# Altium schematic sheet Sheet1.SchDoc
size A3; SheetNumber: 1; SheetTotal: 1; SPICEModelCacheCPTFZSDI: <root> / <DocumentId>CPTFZSDI</DocumentId> / <CacheFrame Number="0"> / <Model Name="umk316ab7475_l-t" Kind="CKT"> / <Text>* UMK316AB7475_L-T     SPICE MODEL  ( General Type ) / *-------------------------------------------------------------------------------------------------------- / * Model Generated by TAIYO YUDEN Corporation (http://www.ty-top.com) / * Version 1.0 / * TAIYO YUDEN Control No. 190215 / * Copyright(c) 2012 TAIYO YUDEN CO.,LTD. All Rights Reserved. / *-------------------------------------------------------------------------------------------------------- / * / * Products Name : Multilayer Ceramic Capacitors / * / * Characteristics : / *     Capacitance : 4.7 uF , Rated Voltage : 50V , TCC : X7R / *     Case Size : 3.2 x 1.6 / 0.126 x 0.063 [mm/inch] , Thickness : 1.6 / 0.063 [mm/inch] / *     (Conditions: Temperature = 25 degC , DC Bias Current/Voltage = 0A / 0V) / * / * Frequency Range : 40Hz - 3GHz / * / * External Node Assignments : / * / *  1  o---| |---o  2 / * / *-------------------------------------------------------------------------------------------------------- / .SubCkt UMK316AB7475_L-T 1 2 / **************************** / C0 1 110 4.2455u / Cm 1 101 0.21463u / C1 101 102 0.30648u / Rc1 101 102 787.3 / C2 102 103 0.28547u / Rc2 102 103 129.89 / C3 103 110 0.083106u / Rc3 103 110 14.697 / C2m 1 301 0.44425u / C21 301 302 1.0217u / Rc21 301 302 3.0262k / C22 302 303 1.2456u / Rc22 302 303 1.8046k / C23 303 304 1.3157u / Rc23 303 304 958.74 / C24 304 305 0.99675u / Rc24 304 305 371.33 / C25 305 306 0.57669u / Rc25 305 306 195.3 / C26 306 307 0.42291u / Rc26 306 307 92.453 / C27 307 308 0.20349u / Rc27 307 308 39.786 / C28 308 309 0.28312u / Rc28 308 309 18.832 / C29 309 110 0.04145u / Rc29 309 110 7.0132 / Rp0 1 110 21.277Meg / L0 110 120 0.27548n / Lm 120 130 0.32065n / L1 120 121 0.37269n / RL1 121 130 0.19231 / L2 120 122 0.48583n / RL2 122 130 0.24566 / L3 120 123 0.60575n / RL3 123 130 18.468 / CR 120 124 0.65041u / LR 124 125 0.59689n / RR 125 130 39.133m / CL 130 140 5.5671p / LL 130 140 0.30868n / RL 130 140 7.7166 / Rs 140 2 3.8119m / **************************** / .ends UMK316AB7475_L-T</Text> / </Model> / <Model Name="umk105b7682_v-f" Kind="CKT"> / <Text>* UMK105B7682_V-F     SPICE MODEL  ( General Type ) / *-------------------------------------------------------------------------------------------------------- / * Model Generated by TAIYO YUDEN Corporation (http://www.ty-top.com) / * Version 1.0 / * TAIYO YUDEN Control No. 170508_080613 / * Copyright(c) 2012 TAIYO YUDEN CO.,LTD. All Rights Reserved. / *-------------------------------------------------------------------------------------------------------- / * / * Products Name : Multilayer Ceramic Capacitors / * / * Characteristics : / *     Capacitance : 6800 pF , Rated Voltage : 50V , TCC : X7R / *     Case Size : 1.0 x 0.5 / 0.039 x 0.02 [mm/inch] , Thickness : 0.5 / 0.02 [mm/inch] / *     (Conditions: Temperature = 25 degC , DC Bias Current/Voltage = 0A / 0V) / * / * Frequency Range : 40Hz - 3GHz / * / * External Node Assignments : / * / *  1  o---| |---o  2 / * / *-------------------------------------------------------------------------------------------------------- / .SubCkt UMK105B7682_V-F 1 2 / **************************** / C0 1 110 5825.1p / Cm 1 101 474.96p / C1 101 102 1651.5p / Rc1 101 102 235.8k / C2 102 103 802.21p / Rc2 102 103 9.8793k / C3 103 110 129.55p / Rc3 103 110 329.06 / C2m 1 301 581.21p / C21 301 302 4468.7p / Rc21 301 302 1.1158G / C22 302 303 5994.1p / Rc22 302 303 757.43k / C23 303 304 4569.8p / Rc23 303 304 462.62k / C24 304 305 3426.1p / Rc24 304 305 19.595k / C25 305 306 2043.2p / Rc25 305 306 31.838k / C26 306 307 3752.9p / Rc26 306 307 660.98 / C27 307 308 1017.9p / Rc27 307 308 421.87 / C28 308 309 320.03p / Rc28 308 309 1.2971k / C29 309 110 5.5474p / Rc29 309 110 160.37 / Rp0 1 110 10G / L0 110 120 0.25038n / Lm 120 130 0.068156n / L1 120 121 4.4767p / RL1 121 130 0.67168 / L2 120 122 0.013458n / RL2 122 130 2.3566 / L3 120 123 0.02002n / RL3 123 130 4.3213 / CR 120 124 1397.3p / LR 124 125 0.079981n / RR 125 130 0.45026 / CL 130 140 1.4554p / LL 130 140 0.22551n / RL 130 140 75.413 / Rs 140 2 73.494m / **************************** / .ends UMK105B7682_V-F</Text> / </Model> / </CacheFrame> / </root>
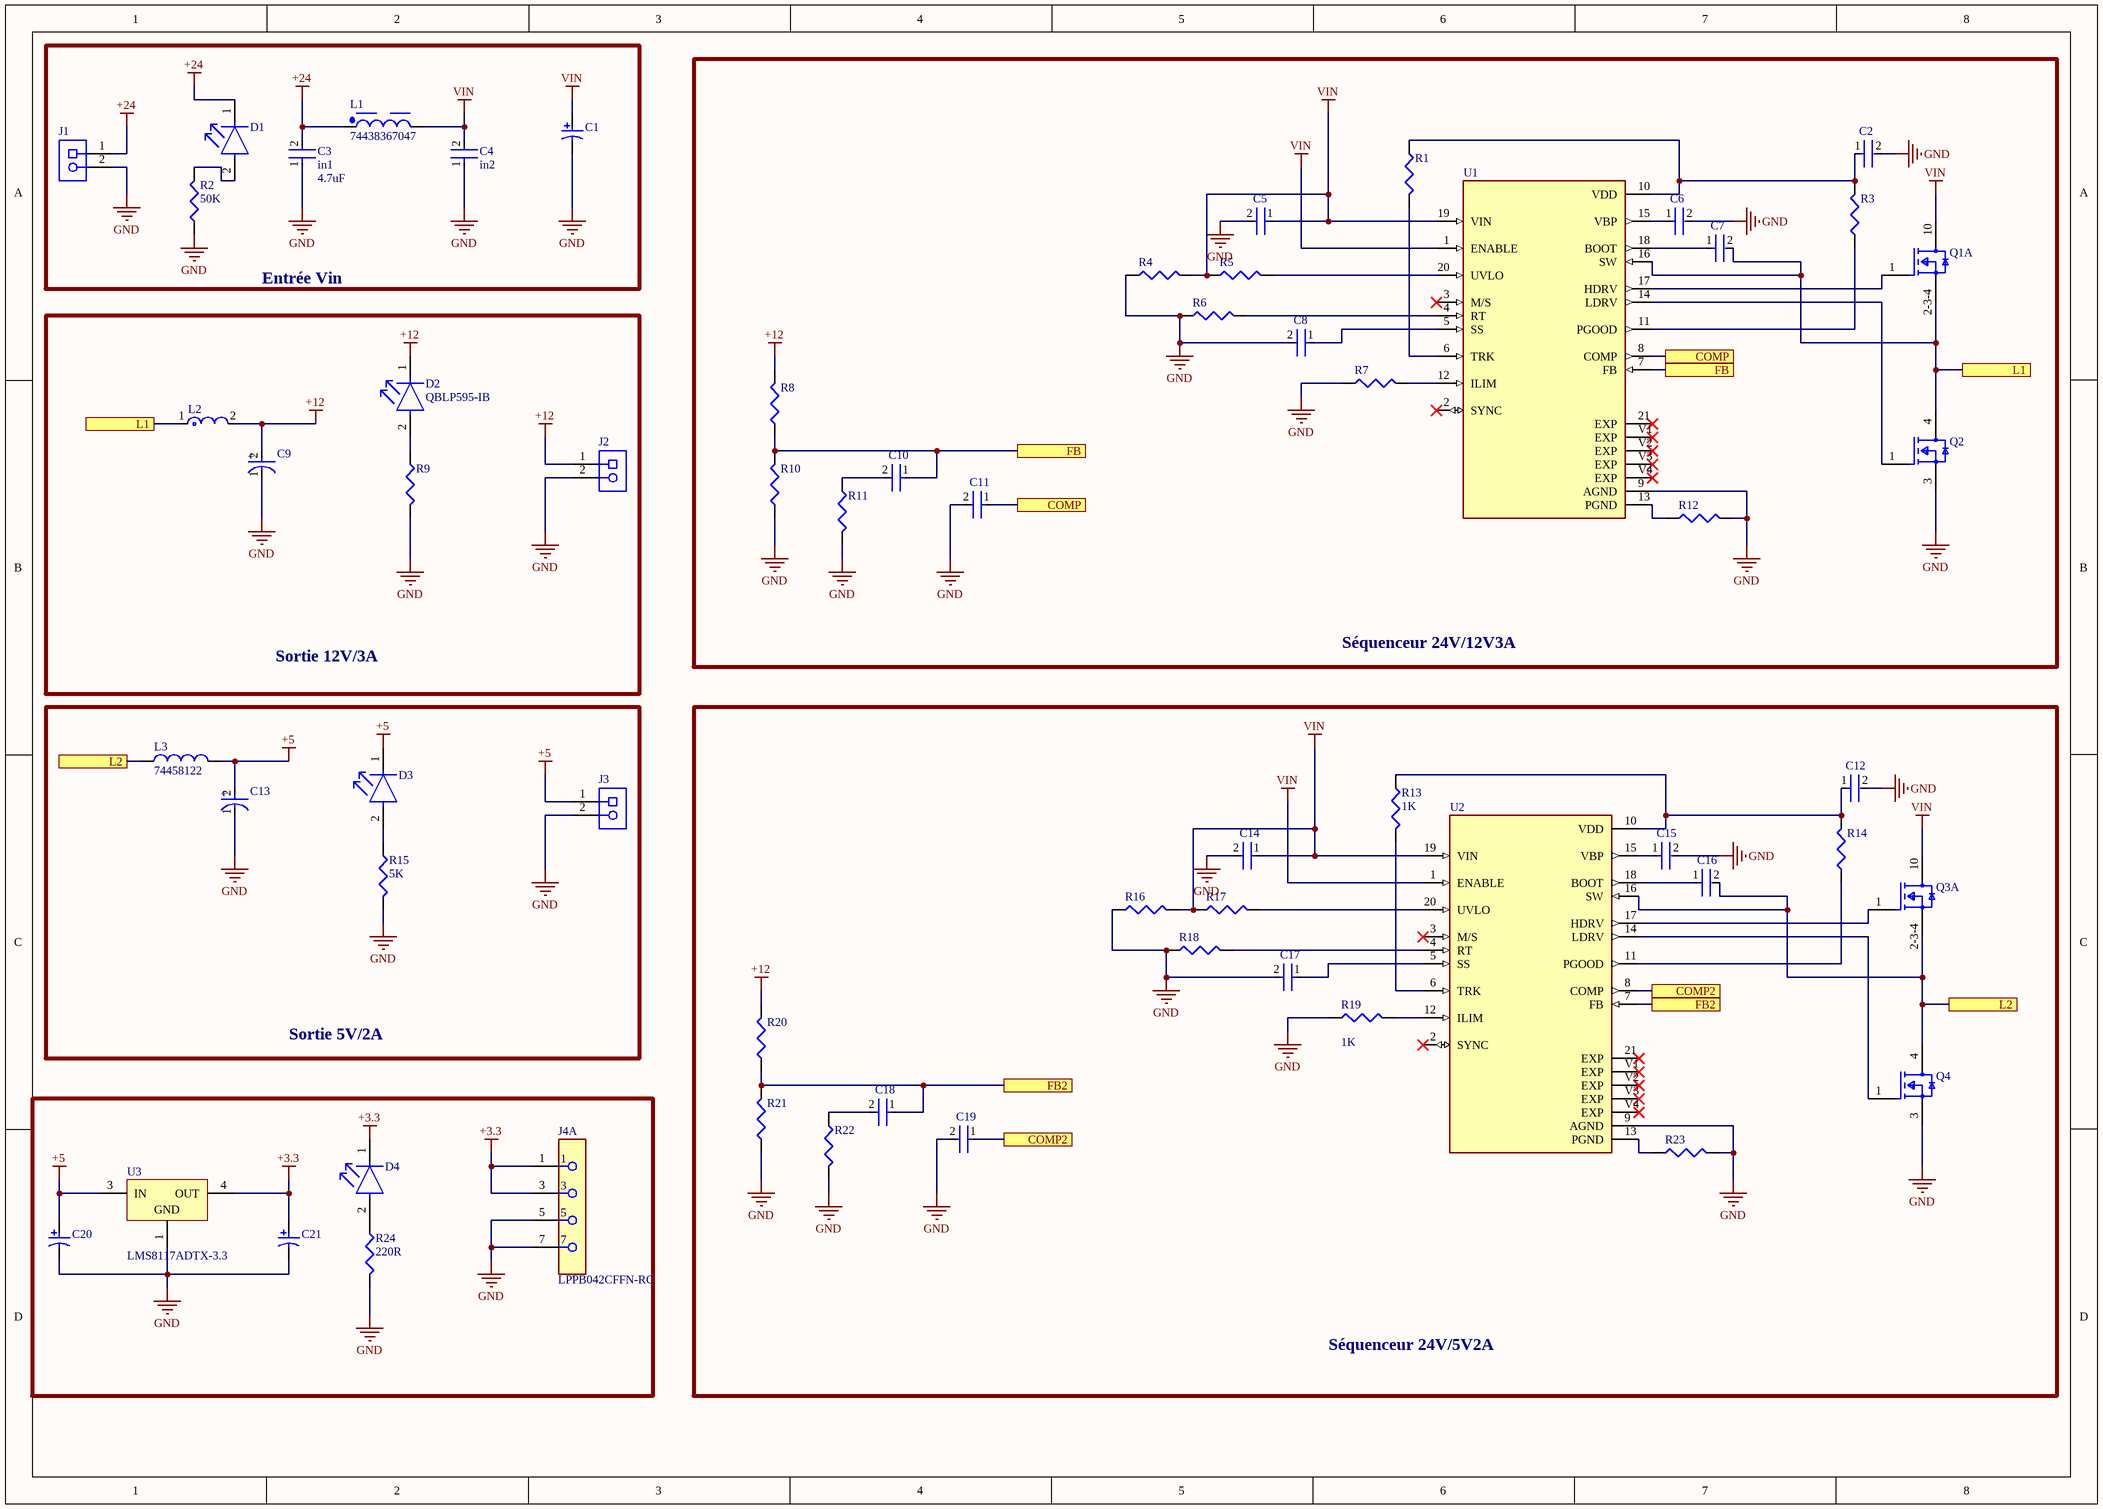
[diagram p0: Sheet1.SchDoc]

## Parts
C1  UUD1H100MCL1GS  [NIC-CAPA2-6.3X5.8_V]  (value not drawn)
C2  (no value)  [FP-0402-L_1_0_0_05-W_0_5-IPC_C]
C3  in1  Capacitance: 4.7uF  [FP-1206-L_3_2_0_2-W_1_6_0-IPC_B]
C4  in2  [FP-0402-L_1_0_0_05-W_0_5-IPC_C]
C5  (no value)  [FP-0402-L_1_0_0_05-W_0_5-IPC_C]
C6  (no value)  [FP-0402-L_1_0_0_05-W_0_5-IPC_C]
C7  (no value)  [FP-0402-L_1_0_0_05-W_0_5-IPC_C]
C8  (no value)  [FP-0402-L_1_0_0_05-W_0_5-IPC_C]
C9  HHXC500ARA101MJA0G  [FP-HXC-ALA0-MFG]  (value not drawn)
C10  (no value)  [FP-0402-L_1_0_0_05-W_0_5-IPC_C]
C11  (no value)  [FP-0402-L_1_0_0_05-W_0_5-IPC_C]
C12  (no value)  [FP-0402-L_1_0_0_05-W_0_5-IPC_C]
C13  HHXC500ARA101MJA0G  [FP-HXC-ALA0-MFG]  (value not drawn)
C14  (no value)  [FP-0402-L_1_0_0_05-W_0_5-IPC_C]
C15  (no value)  [FP-0402-L_1_0_0_05-W_0_5-IPC_C]
C16  (no value)  [FP-0402-L_1_0_0_05-W_0_5-IPC_C]
C17  (no value)  [FP-0402-L_1_0_0_05-W_0_5-IPC_C]
C18  (no value)  [FP-0402-L_1_0_0_05-W_0_5-IPC_C]
C19  (no value)  [FP-0402-L_1_0_0_05-W_0_5-IPC_C]
C20  UUD1H100MCL1GS  [NIC-CAPA2-6.3X5.8_V]  (value not drawn)
C21  UUD1H100MCL1GS  [NIC-CAPA2-6.3X5.8_V]  (value not drawn)
D1  APT1608LZGCK  [FP-APT1608LZGCK-MFG]  (value not drawn)
D2  QBLP595-IB  [FP-QBLP595-IB-MFG]
D3  SML-P11VTT86R  [FP-SML-P1-MFG]  (value not drawn)
D4  APTD1608SYC/J3  [FP-APTD1608SYC-J3-MFG]  (value not drawn)
J1  1729128  [PHOE-1729128-2_V]  (value not drawn)
J2  12V  [PHOE-1729128-2_V]  (value not drawn)
J3  12V  [PHOE-1729128-2_V]  (value not drawn)
J4  LPPB042CFFN-RC  [FP-LPPB042CFFN-RC-MFG]  (part A of 2)
L1  74438367047  [WE-MAPI_5030]
L2  XAL5050-223MEC  [FP-XAL5050-223MEC-MFG]  (value not drawn)
L3  74458122  [WE-PD4_Type X]
Q1  HS1  [FP-511DG-MFG]  (value not drawn)  (part A of 2)
Q2  LS1  [FP-369AS-MFG]  (value not drawn)
Q3  HS1  [FP-511DG-MFG]  (value not drawn)  (part A of 2)
Q4  LS1  [FP-369AS-MFG]  (value not drawn)
R1  Res3  [J1-0603]  (value not drawn)
R2  value 50K  [J1-0603]  (hidden comment: Res3)
R3  Res3  [J1-0603]  (value not drawn)
R4  Res3  [J1-0603]  (value not drawn)
R5  Res3  [J1-0603]  (value not drawn)
R6  Res3  [J1-0603]  (value not drawn)
R7  Res3  [J1-0603]  (value not drawn)
R8  Res3  [J1-0603]  (value not drawn)
R9  Res3  [J1-0603]  (value not drawn)
R10  Res3  [J1-0603]  (value not drawn)
R11  Res3  [J1-0603]  (value not drawn)
R12  Res3  [J1-0603]  (value not drawn)
R13  value 1K  [J1-0603]  (hidden comment: Res3)
R14  Res3  [J1-0603]  (value not drawn)
R15  value 5K  [J1-0603]  (hidden comment: Res3)
R16  Res3  [J1-0603]  (value not drawn)
R17  Res3  [J1-0603]  (value not drawn)
R18  Res3  [J1-0603]  (value not drawn)
R19  value 1K  [J1-0603]  (hidden comment: Res3)
R20  Res3  [J1-0603]  (value not drawn)
R21  Res3  [J1-0603]  (value not drawn)
R22  Res3  [J1-0603]  (value not drawn)
R23  Res3  [J1-0603]  (value not drawn)
R24  value 220R  [J1-0603]  (hidden comment: Res3)
U1  TPS40170RGYT  [QFN50P350X450X100-21N]  (value not drawn)
U2  TPS40170RGYT  [QFN50P350X450X100-21N]  (value not drawn)
U3  LMS8117ADTX-3.3  [TD03B_M]

## Blocks framed on the sheet
Entrée Vin: C1 C3 C4 D1 J1 L1 R2
Séquenceur 24V/12V3A: C2 C5-C8 C10 C11 Q1 Q2 R1 R3-R8 R10-R12 U1
Sortie 12V/3A: C9 D2 J2 L2 R9
Sortie 5V/2A: C13 D3 J3 L3 R15
Séquenceur 24V/5V2A: C12 C14-C19 Q3 Q4 R13 R14 R16-R23 U2

## Ports
COMP2 (see Sheet1[4D]), COMP2 (see Sheet1[7C]), COMP (see Sheet1[4B]), COMP (see Sheet1[7A]), FB2 (see Sheet1[4C]), FB2 (see Sheet1[7C]), FB (see Sheet1[4B]), FB (see Sheet1[7A]), L1 (see Sheet1[1B]), L1 (see Sheet1[8A]), L2 (see Sheet1[1C]), L2 (see Sheet1[8C])

## Nets
+3.3: C21.1 D4.1(C) J4.1 J4.3 U3.4(OUT)
+5: C13.2(A) C20.1 D3.1(C) J3.1 L3.2 U3.3(IN)
+12: C9.2(A) D2.1(C) J2.1 L2.2 R8.2 R20.2
+24: C3.2 D1.1(C) J1.1 L1.1
GND: C1.2 C2.2 C3.1 C4.1 C5.2 C6.2 C8.2 C9.1(C) C11.2 C12.2 C13.1(C) C14.2 C15.2 C17.2 C19.2 C20.2 C21.2 J1.2 J2.2 J3.2 J4.5 J4.7 Q2.3(S) Q4.3(S) R2.1 R4.1 R6.1 R7.1 R9.2 R10.1 R11.2 R12.2 R15.2 R16.1 R18.1 R19.1 R21.1 R22.2 R23.2 R24.2 U1.9(AGND) U2.9(AGND) U3.1(GND)
VIN: C1.1 C4.2 C5.1 C14.1 L1.2 Q1.10(D1) Q3.10(D1) R4.2 R5.1 R16.2 R17.1 U1.1(ENABLE) U1.19(VIN) U2.1(ENABLE) U2.19(VIN)
COMP: C11.1 U1.8(COMP) ; port COMP
COMP2: C19.1 U2.8(COMP) ; port COMP2
FB: C10.1 R8.1 R10.2 U1.7(FB) ; port FB
FB2: C18.1 R20.1 R21.2 U2.7(FB) ; port FB2
L1: C7.2 L2.1 Q1.2-3-4(S1) Q2.4(D) U1.16(SW) ; port L1
L2: C16.2 L3.1 Q3.2-3-4(S1) Q4.4(D) U2.16(SW) ; port L2
NetC2_1: C2.1 R1.1 R3.2 U1.10(VDD)
NetC6_1: C6.1 U1.15(VBP)
NetC7_1: C7.1 U1.18(BOOT)
NetC8_1: C8.1 U1.5(SS)
NetC10_2: C10.2 R11.1
NetC12_1: C12.1 R13.1 R14.2 U2.10(VDD)
NetC15_1: C15.1 U2.15(VBP)
NetC16_1: C16.1 U2.18(BOOT)
NetC17_1: C17.1 U2.5(SS)
NetC18_2: C18.2 R22.1
NetD1_2: D1.2(A) R2.2
NetD2_2: D2.2(A) R9.1
NetD3_2: D3.2(A) R15.1
NetD4_2: D4.2(A) R24.1
NetQ1_1: Q1.1(G1) U1.17(HDRV)
NetQ2_1: Q2.1(G) U1.14(LDRV)
NetQ3_1: Q3.1(G1) U2.17(HDRV)
NetQ4_1: Q4.1(G) U2.14(LDRV)
NetR1_2: R1.2 U1.6(TRK)
NetR3_1: R3.1 U1.11(PGOOD)
NetR5_2: R5.2 U1.20(UVLO)
NetR6_2: R6.2 U1.4(RT)
NetR7_2: R7.2 U1.12(ILIM)
NetR12_1: R12.1 U1.13(PGND)
NetR13_2: R13.2 U2.6(TRK)
NetR14_1: R14.1 U2.11(PGOOD)
NetR17_2: R17.2 U2.20(UVLO)
NetR18_2: R18.2 U2.4(RT)
NetR19_2: R19.2 U2.12(ILIM)
NetR23_1: R23.1 U2.13(PGND)

Not connected (* = marked no-connect by the designer): U1 2(SYNC)* 3(M/S)* 21(EXP)* V1(EXP)* V2(EXP)* V3(EXP)* V4(EXP)*; U2 2(SYNC)* 3(M/S)* 21(EXP)* V1(EXP)* V2(EXP)* V3(EXP)* V4(EXP)*

## Notes on the sheet
- (in symbol CMP-33769-000007-1) +

## Library data of the parts
C1 = CMP-0687-00043-1: Aluminum Electrolytic Capacitor, UD Series, Low Impedance, 10 uF, 50 V, + / - 20%, -55 to 105 degC, Chip Type, 6.3 x 5.8 mm D x L, Pb-Free, Reel; Manufacturer: Nichicon; Impedance: 0.88 Ohm; Rated Voltage: 50 V; Endurance Time: 2000 h; Rated Ripple Current (at 100kHz): 165 mA; Packing: Dia382mm Reel; Rated Capacitance: 10 uF; Tolerance Rated Capacitance: -20 to 20%; ComponentLink2Description: Datasheet; Length: 5.8 mm; ComponentLink2URL: http://products.nichicon.co.jp/en/pdf/XJA043/e-ud.pdf; RoHS: TRUE; DatasheetVersion: 08/2012; ComponentLink3URL: http://products.nichicon.co.jp/en/pdf/XJA043/e-ud.pdf; ComponentLink3Description: Package Specification; ComponentLink1Description: Manufacturer URL; Mounting Technology: Surface Mount; PartNumber: UUD1H100MCL1GS; ComponentLink1URL: http://www.nichicon.co.jp/; PackageDescription: 2-Pin Surface Mount Device, Diameter 6.3 mm, Height 5.8 mm, Pitch 5.4 mm; PackageReference: CAPAE-D6.3H5.8; Diameter: 6.3 mm
C2 C5 C7 C8 C10-C12 C14 C16-C19 = CMP-14477-001974-2: None; Voltage Rating: 50V; Dielectric: X7R; Tolerance: 10%; Capacitance: 0.1uF; Series: M; Termination: SMD/SMT; Halogen Free: Halogen Free; Radiation Hardening: No; Package Quantity: 10000; Thickness: 0.022inch; Case/Package: 0402; Case Code (Metric): 1005; Max Operating Temperature: 125°C; Depth: 0.5mm; Case Code (Imperial): 0402; Construction: Flat; Length: 1mm; Lead Free: Lead Free; Voltage Rating (DC): 50V; RoHS Compliant: Yes; Mount: Surface Mount; Width: 0.02inch; Height: 0.5mm; Voltage: 50V; Packaging: Tape and Reel; Min Operating Temperature: -55°C
C3 = CMP-2000-07358-3: None; Dielectric: X7R; Tolerance: 10%; Voltage Rating (DC): 50V; Radiation Hardening: No; Case Code (Metric): 3216; Thickness: 0.071inch; Series: M; Number of Pins: 2; Depth: 1.6mm; Mount: Surface Mount; Case/Package: 1206; Min Operating Temperature: -55°C; Width: 1.6mm; RoHS Compliant: Yes; Voltage Rating: 50V; Package Quantity: 2000; Length: 3.2mm; Packaging: Tape and Reel; Height: 1.6mm; Termination: SMD/SMT; Construction: Flat; Max Operating Temperature: 125°C; Case Code (Imperial): 1206
C4 = CMP-14477-001974-2: None; Voltage Rating: 50V; Dielectric: X7R; Tolerance: 10%; Capacitance: 6.8nF; Series: M; Termination: SMD/SMT; Halogen Free: Halogen Free; Radiation Hardening: No; Package Quantity: 10000; Thickness: 0.022inch; Case/Package: 0402; Case Code (Metric): 1005; Max Operating Temperature: 125°C; Depth: 0.5mm; Case Code (Imperial): 0402; Construction: Flat; Length: 1mm; Lead Free: Lead Free; Voltage Rating (DC): 50V; RoHS Compliant: Yes; Mount: Surface Mount; Width: 0.02inch; Height: 0.5mm; Voltage: 50V; Packaging: Tape and Reel; Min Operating Temperature: -55°C
C6 C15 = CMP-14477-001974-2: None; Voltage Rating: 50V; Dielectric: X7R; Tolerance: 10%; Capacitance: 4.7uF; Series: M; Termination: SMD/SMT; Halogen Free: Halogen Free; Radiation Hardening: No; Package Quantity: 10000; Thickness: 0.022inch; Case/Package: 0402; Case Code (Metric): 1005; Max Operating Temperature: 125°C; Depth: 0.5mm; Case Code (Imperial): 0402; Construction: Flat; Length: 1mm; Lead Free: Lead Free; Voltage Rating (DC): 50V; RoHS Compliant: Yes; Mount: Surface Mount; Width: 0.02inch; Height: 0.5mm; Voltage: 50V; Packaging: Tape and Reel; Min Operating Temperature: -55°C
C9 C13 = CMP-33769-000007-1: CAP ALUM POLY 100UF 20% 50V SMD; Life (Hours): 4000Hour; ESR (Equivalent Series Resistance): 25mR; Packaging: Cut Tape; Case/Package: Radial; Capacitance: 100uF; Resistor Type: Hybrid; Max Operating Temperature: 125°C; Voltage Rating: 50V; Min Operating Temperature: -55°C; RoHS Compliant: Yes; Tolerance: 20%; Ratings: AEC-Q200; Mount: Surface Mount
C20 = CMP-0687-00043-1: Aluminum Electrolytic Capacitor, UD Series, Low Impedance, 10 uF, 50 V, + / - 20%, -55 to 105 degC, Chip Type, 6.3 x 5.8 mm D x L, Pb-Free, Reel; Manufacturer: Nichicon; Impedance: 0.88 Ohm; Rated Voltage: 50 V; Endurance Time: 2000 h; Rated Ripple Current (at 100kHz): 165 mA; Packing: Dia382mm Reel; Rated Capacitance: 0.47 uF; Tolerance Rated Capacitance: -20 to 20%; ComponentLink2Description: Datasheet; Length: 5.8 mm; ComponentLink2URL: http://products.nichicon.co.jp/en/pdf/XJA043/e-ud.pdf; RoHS: TRUE; DatasheetVersion: 08/2012; ComponentLink3URL: http://products.nichicon.co.jp/en/pdf/XJA043/e-ud.pdf; ComponentLink3Description: Package Specification; ComponentLink1Description: Manufacturer URL; Mounting Technology: Surface Mount; PartNumber: UUD1H100MCL1GS; ComponentLink1URL: http://www.nichicon.co.jp/; PackageDescription: 2-Pin Surface Mount Device, Diameter 6.3 mm, Height 5.8 mm, Pitch 5.4 mm; PackageReference: CAPAE-D6.3H5.8; Diameter: 6.3 mm
C21 = CMP-0687-00043-1: Aluminum Electrolytic Capacitor, UD Series, Low Impedance, 10 uF, 50 V, + / - 20%, -55 to 105 degC, Chip Type, 6.3 x 5.8 mm D x L, Pb-Free, Reel; Manufacturer: Nichicon; Impedance: 0.88 Ohm; Rated Voltage: 50 V; Endurance Time: 2000 h; Rated Ripple Current (at 100kHz): 165 mA; Packing: Dia382mm Reel; Rated Capacitance: 33 uF; Tolerance Rated Capacitance: -20 to 20%; ComponentLink2Description: Datasheet; Length: 5.8 mm; ComponentLink2URL: http://products.nichicon.co.jp/en/pdf/XJA043/e-ud.pdf; RoHS: TRUE; DatasheetVersion: 08/2012; ComponentLink3URL: http://products.nichicon.co.jp/en/pdf/XJA043/e-ud.pdf; ComponentLink3Description: Package Specification; ComponentLink1Description: Manufacturer URL; Mounting Technology: Surface Mount; PartNumber: UUD1H100MCL1GS; ComponentLink1URL: http://www.nichicon.co.jp/; PackageDescription: 2-Pin Surface Mount Device, Diameter 6.3 mm, Height 5.8 mm, Pitch 5.4 mm; PackageReference: CAPAE-D6.3H5.8; Diameter: 6.3 mm
D1 = CMP-44529-000040-1: LED GREEN CLEAR 2SMD; Dominant Wavelength: 525nm; Forward Voltage: 2.65V; Luminous Intensity: 50mcd; Test Current: 2mA; Viewing Angle: 120°; Lens Color: Colorless; Width: 0.8mm; Mount: Surface Mount; Lens Transparency: Clear; Length: 1.6mm; Packaging: Cut Tape; Case Code (Metric): 1608; Height: 0.75mm; Case/Package: 0603; Case Code (Imperial): 0603; Color: Green
D2 = CMP-113271-000002-1: LED BLUE CLEAR 0402 SMD; Lens Size: 0.5mm; Dominant Wavelength: 465nm; Forward Voltage: 3.1V; Lens Color: Colorless; Luminous Intensity: 85mcd; Test Current: 20mA; Viewing Angle: 140°; Lens Style: Flat; Width: 0.5mm; Case Code (Metric): 1005; Lens Transparency: Clear; Color: Blue; Packaging: Tape and Reel; Case Code (Imperial): 0402; Mount: Surface Mount; Length: 1mm; Case/Package: 0402; Height: 0.6mm
D3 = CMP-08952-000003-1: LED RED CLEAR 1006 SMD; Manufacturer: Rohm; Led Orientation: Top View; Power Dissipation: 50mW; Wavelength: 626nm; Forward Voltage: 1.8V; Forward Current: 1mA; Luminous Intensity: 4mcd; Reverse Voltage: 5V; ComponentLink2URL: https://www.rohm.com/datasheet/SML-P11VT(R)/sml-p11-e; Temperature: -40°C to +85°C; Device Class L2: LEDs; Package: SML-P1; Category: Diode; Automotive: No; RoHS: TRUE; Lead Free: Yes; Digikey Description: LED RED CLEAR 1006 SMD; Manufacturer Part Number: SML-P11VTT86R; Device Class L3: unset; ComponentLink2Description: Datasheet; Octopart: https://octopart.com/sml-p11vtt86r-rohm-34112314; Device Class L1: Optoelectronics; Temperature Range High: +85°C; Temperature Range Low: -40°C; Mouser Description: SML-P11 Series Red 0402 Clear 4 mcd 1.8 V Surface Mount PICOLED? LED; Height: 0.25mm; Colour: Red
D4 = CMP-44529-000016-1: LED YELLOW CLEAR CHIP SMD; Forward Current: 20mA; Luminous Intensity: 900mcd; Dominant Wavelength: 590nm; Viewing Angle: 60°; Lens Color: Colorless; Forward Voltage: 2V; Case Code (Imperial): 0603; Lens Transparency: Clear; Height: 0.95mm; Case Code (Metric): 1608; Package Quantity: 2000; Mount: Surface Mount; Test Current: 20mA; Max Operating Temperature: 85°C; Length: 1.6mm; Lens Style: Clear; Illumination Color: Yellow; Packaging: Tape and Reel; Case/Package: 0603; Color: Yellow; Width: 0.8mm; Lead Free: Lead Free; Min Operating Temperature: -40°C
J1 = CMP-2000-05815-1: PCB Terminal Block, 13.5 A, 400 V, 2-Pin THD, RoHS, Bulk; Manufacturer: Phoenix Contact; Package Version: 03/2015; No. of Rows: 1; Pitch: 5.08mm; No. of Positions: 2; Voltage Rating: 400V; Current Rating: 13500mA; Manufacturer URL: http://www.phoenixcontact.com/; Datasheet URL: https://datasheet.ciiva.com/16046/1729128-16046181.pdf; RoHS: TRUE; Package URL: https://www.phoenixcontact.com/online/portal/pi/pxc/product_detail_page/!ut/p/b1/3VdJjqNKFDxLH8AFycySyWY2ozFsEPOMMQaDOX1XedGL_1Vdm5YXJleknhSKeBkvI6EA8ncAo3AYoDhBQGco6KN7VURTdemj9us_IEKEZo_YHiPAEWEFmDGOHMORkqKYCORBZxgL7ZoaZYcbFFUZ3fqxSY6GOuxydWUuHqz1ynmMFygu583Bob0Ewr6Sd_l-5m-kAueHiB0jpRwZwe58wwtkpxtMYd_LmGcDRU02dRNEyWt6Y2ti5pSyJ_reIkzIulrqApdnbT11V5jnCKbYNCvhEM1MCpPByat_X379-iThf08CI5GfOPqfBeS3BRoBOdD55AKVv0iLwCMq-2BrzXWSGRH7pUGD9uwXQjiph3xL0DKQwdGa0JImiIOmBNOestqgwTHSSs2oOep-78apyXQBvNi8ZLaFjvjWvcaUEBu0MC6Wbe-d6mB0FAebo2lUWinqYaZs5DAYzV0RP9yitUjnGJ0iI9xhZkT42OCQNUJJhkgWINNQLP2JFP6OpMg3JCVg70jqHT0lvKOnhHf0lPuOnnLf0VPuWx6_dxwUIvwk5WMkT0kLL1mh61l2yZVSzG3pYV_bqo-mj6uMKwKwdnnW8Jh5RTOJzMOA5c-eJDaZQw4mTMPH02PvS_ZAqNVjVTo2WyYLkwH_KU1mmmG5kjRhDqPXLwwVHvVOjCM60-fpXvTDfMGW1PVFVS1r4e4yVDk4ZdNbkUHvqPqQSeian4UD39fNKmachqdJ1NJbyk8rXT9mXTvPk3oE5meulKGgiruPJek-4I9hTT6G8ZLOyRSm2RRVbThERQad5OS28hdt4YW4vG0stgYYzsWsK4_7y6DZMjJSCqri1kyiZR5vD7pwIrNR7QwPHTcLTI5qT7eRlpHrdGiupYlqQDJ7zy_CND8fWWBoLRXxk1RVcXiBQwbTD4Xi7KL-FuO94t9xaqweXzH; PartNumber: 1729128; Package Description: 2-Pin Through Hole Device, Body 8.1 x 10.16 mm, Pitch 5.08 mm; Datasheet Version: 12/2013; Mounting Technology: ThroughHole; Orientation: Horizontal; Package Reference: 1729128-2; Packing: Bulk
J2 J3 = CMP-2000-05815-1: PCB Terminal Block, 13.5 A, 400 V, 2-Pin THD, RoHS, Bulk; PartNumber: 1729128; Manufacturer: Phoenix Contact; Package Version: 03/2015; No. of Rows: 1; Pitch: 5.08mm; No. of Positions: 2; Voltage Rating: 400V; Current Rating: 13500mA; Manufacturer URL: http://www.phoenixcontact.com/; Datasheet URL: https://datasheet.ciiva.com/16046/1729128-16046181.pdf; RoHS: TRUE; Package URL: https://www.phoenixcontact.com/online/portal/pi/pxc/product_detail_page/!ut/p/b1/3VdJjqNKFDxLH8AFycySyWY2ozFsEPOMMQaDOX1XedGL_1Vdm5YXJleknhSKeBkvI6EA8ncAo3AYoDhBQGco6KN7VURTdemj9us_IEKEZo_YHiPAEWEFmDGOHMORkqKYCORBZxgL7ZoaZYcbFFUZ3fqxSY6GOuxydWUuHqz1ynmMFygu583Bob0Ewr6Sd_l-5m-kAueHiB0jpRwZwe58wwtkpxtMYd_LmGcDRU02dRNEyWt6Y2ti5pSyJ_reIkzIulrqApdnbT11V5jnCKbYNCvhEM1MCpPByat_X379-iThf08CI5GfOPqfBeS3BRoBOdD55AKVv0iLwCMq-2BrzXWSGRH7pUGD9uwXQjiph3xL0DKQwdGa0JImiIOmBNOestqgwTHSSs2oOep-78apyXQBvNi8ZLaFjvjWvcaUEBu0MC6Wbe-d6mB0FAebo2lUWinqYaZs5DAYzV0RP9yitUjnGJ0iI9xhZkT42OCQNUJJhkgWINNQLP2JFP6OpMg3JCVg70jqHT0lvKOnhHf0lPuOnnLf0VPuWx6_dxwUIvwk5WMkT0kLL1mh61l2yZVSzG3pYV_bqo-mj6uMKwKwdnnW8Jh5RTOJzMOA5c-eJDaZQw4mTMPH02PvS_ZAqNVjVTo2WyYLkwH_KU1mmmG5kjRhDqPXLwwVHvVOjCM60-fpXvTDfMGW1PVFVS1r4e4yVDk4ZdNbkUHvqPqQSeian4UD39fNKmachqdJ1NJbyk8rXT9mXTvPk3oE5meulKGgiruPJek-4I9hTT6G8ZLOyRSm2RRVbThERQad5OS28hdt4YW4vG0stgYYzsWsK4_7y6DZMjJSCqri1kyiZR5vD7pwIrNR7QwPHTcLTI5qT7eRlpHrdGiupYlqQDJ7zy_CND8fWWBoLRXxk1RVcXiBQwbTD4Xi7KL-FuO94t9xaqweXzH; Package Description: 2-Pin Through Hole Device, Body 8.1 x 10.16 mm, Pitch 5.08 mm; Datasheet Version: 12/2013; Mounting Technology: ThroughHole; Orientation: Horizontal; Package Reference: 1729128-2; Packing: Bulk
J4 = CMP-25680-000056-1: CONN HDR 8POS 0.05 GOLD PCB; Number of Positions: 8; Pitch: 0.05inch; Connector Type: Header; Lead Free: Lead Free; Contact Type: Female Socket; Contact Plating: Gold; Number of Rows: 2; Packaging: Bulk; Mount: Through Hole; Package Quantity: 1; Termination: Solder; Row Spacing: 0.05inch
L1 = CMP-03913-107500293-2: 74438367047 Inductor, 4.7Uh, Shielded, 5.5A Rohs Compliant: Yes; DC Resistance (DCR): 30mΩ; Inductance: 4.7µH; RoHS: Compliant; NexarPartId: 107500293; Min Operating Temperature: -40°C; Max Operating Temperature: 125°C; Ambient Temperature Range Low: -40°C; Length: 5.4mm; Width: 5.4mm; Height: 3.1mm; Ambient Temperature Range High: 85°C; Current Rating: 5.5A
L2 = CMP-11268-000132-1: Fixed Inductors 22uH Shld 20% 3.4A 99.65mOhms AECQ2; Saturation Current: 3.6A; Test Frequency: 100kHz; Self Resonant Frequency: 11MHz; Shielding: Shielded; Core Material: Composite; DC Resistance (DCR): 99.65mR; Termination: SMD/SMT; Series: XAL5050; Inductance: 22uH; Width: 5.48mm; Height: 5.1mm; Tolerance: 20%; REACH SVHC: No SVHC; Length: 5.68mm; Min Operating Temperature: -40°C; Case/Package: SMD/SMT; RMS Current (Irms): 3.4A; Mount: Surface Mount; Inductance Tolerance: 20%; Lead Free: Contains Lead; RoHS Compliant: Yes; Max DC Current: 3.4A; Package Quantity: 250; Packaging: Tape and Reel; Max Operating Temperature: 125°C
L3 = CMP-0227-00683-2: NexarPartId: 8917327; Inductance Tolerance: 20%; Inductance: 22µH; Test Frequency: 100kHz; Resistance: 43mΩ; Current Rating: 3.5A; Self Resonant Frequency: 13MHz; Core Material: Ferrite; Shielding: Unshielded; Saturation Current: 7A; Height - Seated (Max): 7.112mm; REACH SVHC: Unknown; Height: 7.11mm; Ambient Temperature Range Low: -40°C; Width: 15.24mm; Case/Package: Nonstandard; Packaging: Cut Tape (CT); RoHS: Compliant; Min Operating Temperature: -40°C; Composition: Wirewound; Max Operating Temperature: 125°C; Mount: Surface Mount; Ambient Temperature Range High: 85°C; Tolerance: 20%; RMS Current (Irms): 3.5A; Number of Pins: 2; DC Resistance (DCR): 43mΩ; Length: 18.54mm
Q1 Q3 = CMP-00278-84602795-1: FDMC9430L-F085 Dual N-Channel Logic Level PowerTrench® MOSFET 40V, 12A, 8.2mΩ; Manufacturer Lifecycle Status: ACTIVE; Max Junction Temperature (Tj): 150°C; Number of Channels: 2; Gate to Source Voltage (Vgs): 12V; Turn-Off Delay Time: 17ns; Turn-On Delay Time: 7ns; Power Dissipation: 11.4W; Drain to Source Resistance: 6.3mΩ; NexarPartId: 84602795; Lifecycle Status: Production; Min Operating Temperature: -55°C; Max Operating Temperature: 150°C; Element Configuration: Dual; Weight: 196mg; RoHS: Compliant; Continuous Drain Current (ID): 12A; Mount: Surface Mount; Height: 800µm; Drain to Source Breakdown Voltage: 40V; Schedule B: 8541290080; Drain to Source Voltage (Vdss): 40V
Q2 Q4 = CMP-00278-84602781-1: FDD86581-F085 PowerTrench® MOSFET, N-Channel, 60 V, 25 A, 15 mΩ; Manufacturer Lifecycle Status: LAST SHIPMENTS; Number of Channels: 1; Continuous Drain Current (ID): 25A; Drain to Source Breakdown Voltage: 60V; Turn-On Delay Time: 7.5ns; Max Junction Temperature (Tj): 175°C; Power Dissipation: 48.4W; Drain to Source Resistance: 12.3mΩ; Turn-Off Delay Time: 14.6ns; Element Configuration: Single; Gate to Source Voltage (Vgs): 20V; Lifecycle Status: EOL; Weight: 260.37mg; NexarPartId: 84602781; Max Operating Temperature: 175°C; Min Operating Temperature: -55°C; Height: 2.517mm; Schedule B: 8541290080, 8541290080; RoHS: Compliant; Drain to Source Voltage (Vdss): 60V; Mount: Surface Mount
R1 R3-R8 R10-R12 R14 R16-R18 R20-R23 = Res3: Resistor; Value: 1K; Published: 8-Jun-2000; LatestRevisionDate: 29-May-2009; LatestRevisionNote: IPC-7351 Footprint Added.; PackageReference: J1-0603; Publisher: Altium Limited; PackageDescription: Chip Resistor
R2 R13 R15 R19 R24 = Res3: Resistor; Published: 8-Jun-2000; LatestRevisionDate: 29-May-2009; LatestRevisionNote: IPC-7351 Footprint Added.; PackageReference: J1-0603; Publisher: Altium Limited; PackageDescription: Chip Resistor
R9 = Res3: Resistor; Value: 590R; Published: 8-Jun-2000; LatestRevisionDate: 29-May-2009; LatestRevisionNote: IPC-7351 Footprint Added.; PackageReference: J1-0603; Publisher: Altium Limited; PackageDescription: Chip Resistor
U1 U2 = TPS40170RGYT: 4.5 V to 60 V Wide-Input Synchronous PWM Buck Controller; MF: Texas Instruments; SnapEDA_Link: https://www.snapeda.com/parts/TPS40170RGYT/Texas+Instruments/view-part/?ref=snap; Package: VQFN-20 Texas Instruments; Value: *; MP: TPS40170RGYT; Check_prices: https://www.snapeda.com/parts/TPS40170RGYT/Texas+Instruments/view-part/?ref=eda
U3 = CMP-0062-00182-2: 1A Low-Dropout Linear Regulator, 3-pin TO-252; Manufacturer: National Semiconductor; CompType: LDO IC; PowerWise: N; PackageTopMarking: NSUZXYTT*LMS8117*ADT-3.3; ComponentLink3Description: TD03B Package Page; PinCount: 3; ComponentLink3URL: http://www.national.com/packaging/folders/td03b.html; Code_JEDEC: TO-252-AA; ComponentLink2Description: LMS8117A Web Page; PackageDescription: TO252, Molded, Jedec, 6.8 x 6.10 x 2.30mm Body, 3 Lead, 2.28mm Pitch, Surface Mount; RevisionNote: Component URLs added; ComponentLink2URL: http://www.national.com/pf/LM/LMS8117A.html; ComponentLink1Description: LMS8117A Datasheet; ComponentLink1URL: http://www.national.com/ds/LM/LMS8117A.pdf; DatasheetVersion: Apr-2005; RoHS: N; PackageVersion: revD, Feb-2009; PackageReference: TD03B